# EAGLE design zamek (EAGLE 7.7.0)
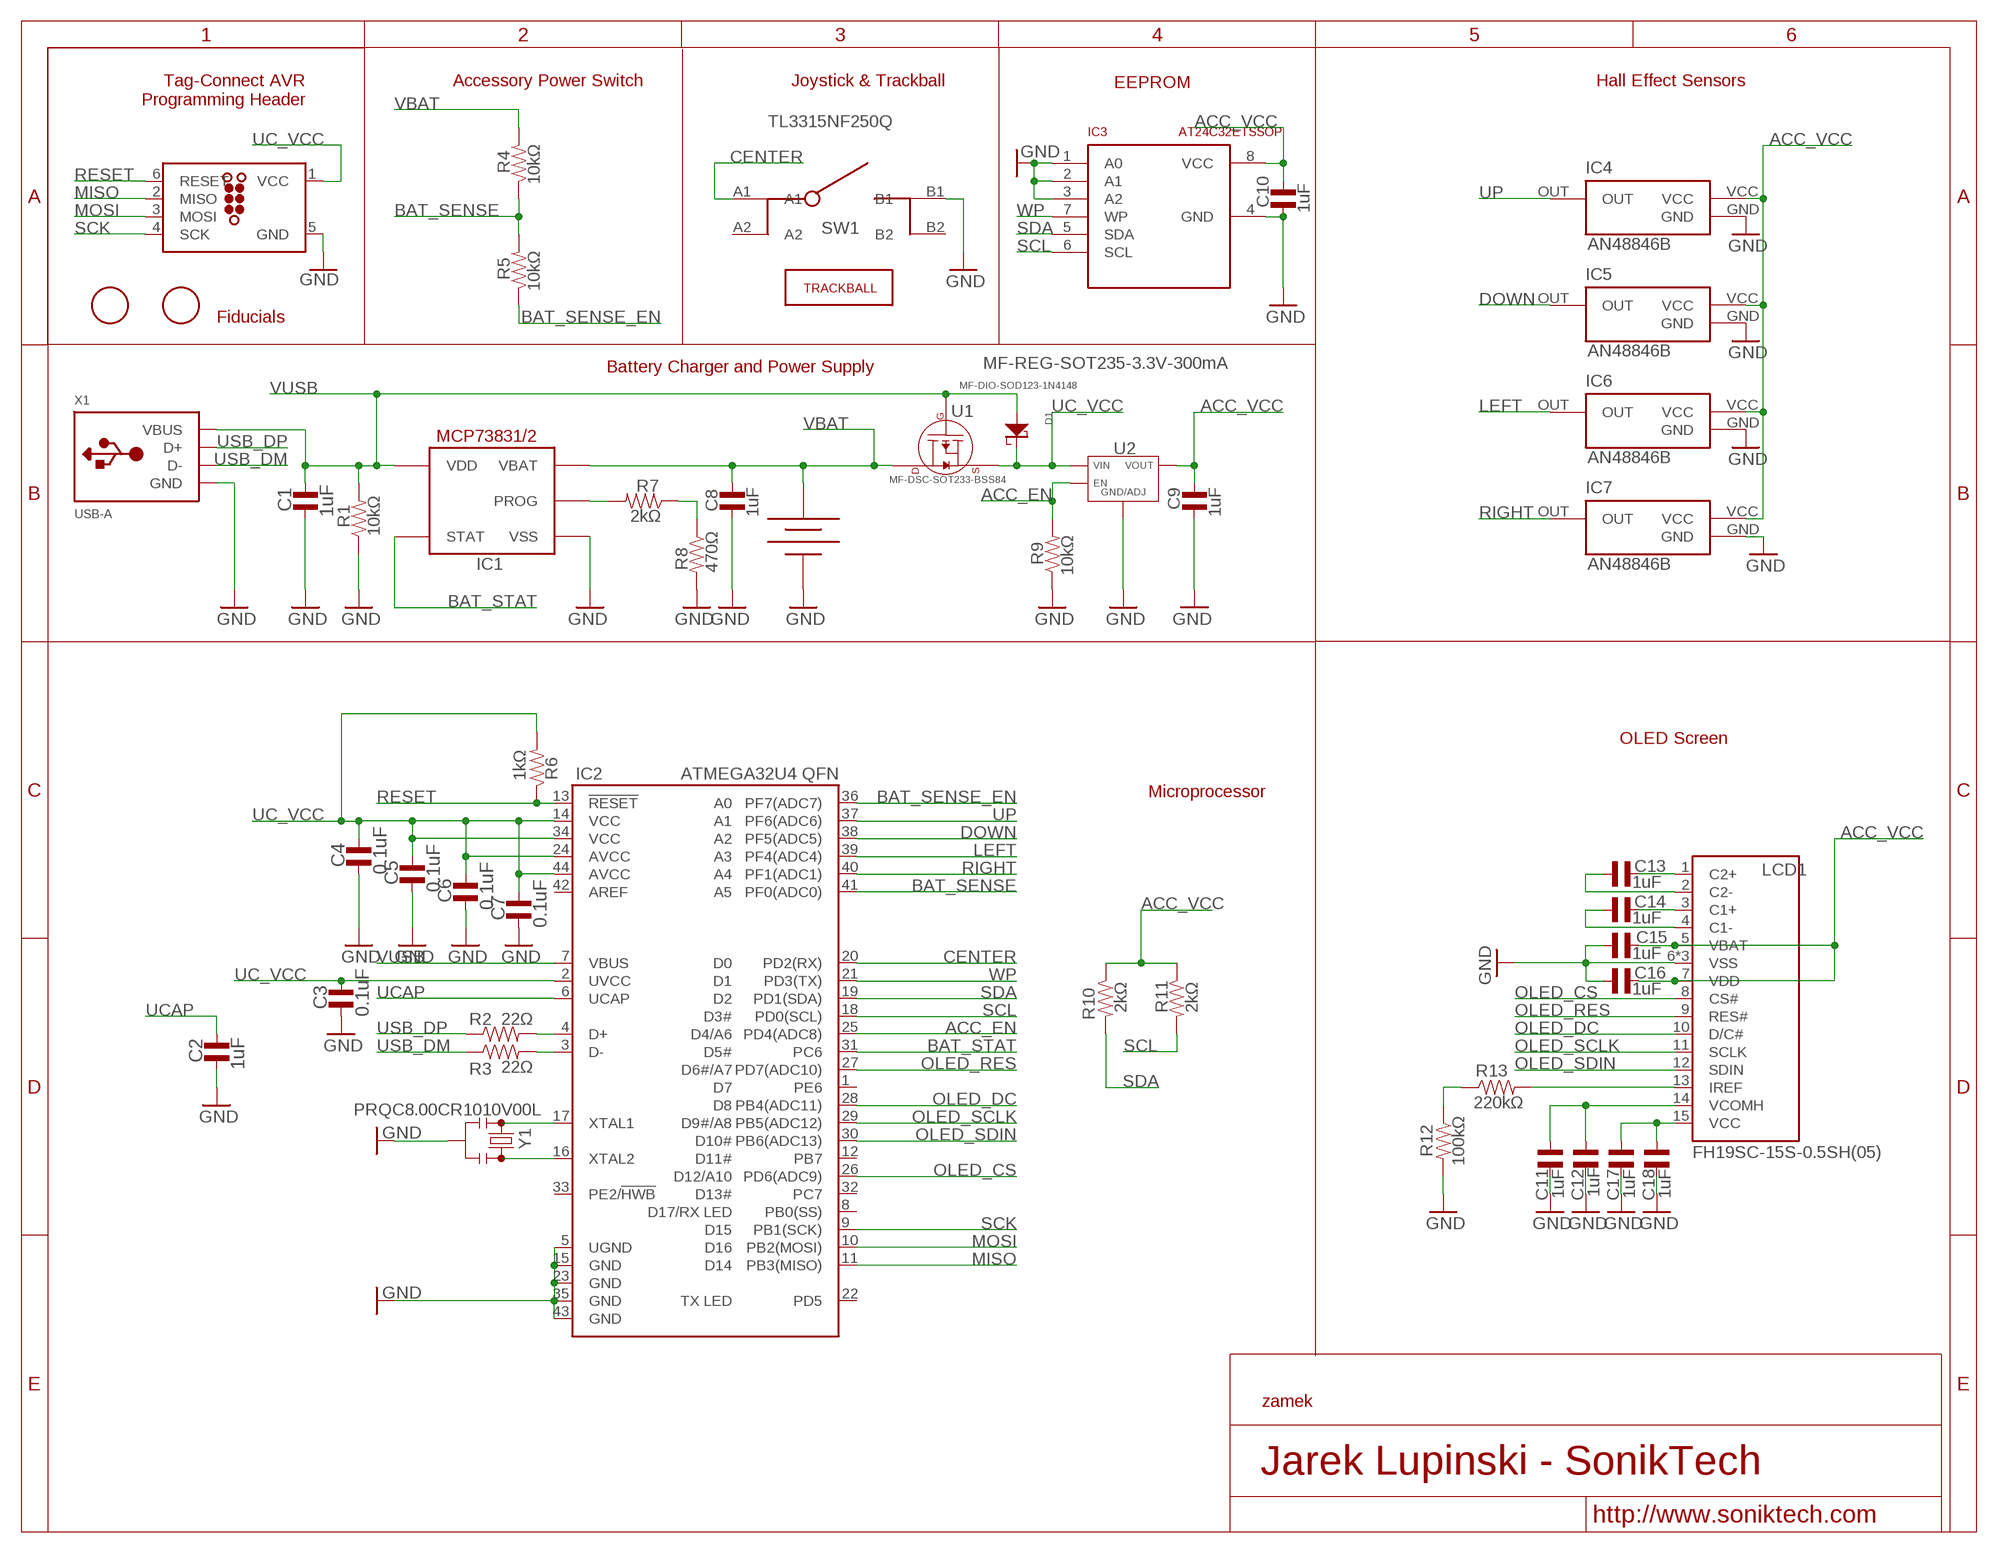
[diagram p0: schematic, sheet 1]

## Parts
BAT1  LIPO201030  [201030LIPO]
C1  1uF  CAPACITOR_NP_0402  [C0402]
C2  1uF  CAPACITOR_NP_0402  [C0402]
C3  0.1uF  CAPACITOR_NP_0402  [C0402]
C4  0.1uF  CAPACITOR_NP_0402  [C0402]
C5  0.1uF  CAPACITOR_NP_0402  [C0402]
C6  0.1uF  CAPACITOR_NP_0402  [C0402]
C7  0.1uF  CAPACITOR_NP_0402  [C0402]
C8  1uF  CAPACITOR_NP_0402  [C0402]
C9  1uF  CAPACITOR_NP_0402  [C0402]
C10  1uF  CAPACITOR_NP_0402  [C0402]
C11  1uF  CAPACITOR_NP_0402  [C0402]
C12  1uF  CAPACITOR_NP_0402  [C0402]
C13  1uF  CAPACITOR_NP_0402  [C0402]
C14  1uF  CAPACITOR_NP_0402  [C0402]
C15  1uF  CAPACITOR_NP_0402  [C0402]
C16  1uF  CAPACITOR_NP_0402  [C0402]
C17  1uF  CAPACITOR_NP_0402  [C0402]
C18  1uF  CAPACITOR_NP_0402  [C0402]
D1  MF-DIO-SOD123-1N4148  DIODES_SOD-123  [SOD-123]
IC1  MCP73831  MCP73831MF  [MFSOT23-5L]
IC2  ATMEGA32U4 QFN  ATMEGA32U4QFN2  [QFN-44-NOPAD]
IC3  AT24C32ETSSOP  [TSSOP8-W]
IC4  AN48846B  HALLSENSOR  [HALLSENSOR]
IC5  AN48846B  HALLSENSOR  [HALLSENSOR]
IC6  AN48846B  HALLSENSOR  [HALLSENSOR]
IC7  AN48846B  HALLSENSOR  [HALLSENSOR]
J1  TC2030-MCP-NLFIX  [TC2030-MCP-NL]
LCD1  FH19SC-15S-0.5SH(05)  MICROBUILDER_OLED_UG-2832HSWEG04  [ER-OLED0.91-3WWFH19C]
R1  10kΩ  RESISTOR_0402  [R0402]
R2  22Ω  RESISTOR_0402  [R0402]
R3  22Ω  RESISTOR_0402  [R0402]
R4  10kΩ  RESISTOR_0402  [R0402]
R5  10kΩ  RESISTOR_0402  [R0402]
R6  1kΩ  RESISTOR_0402  [R0402]
R7  2kΩ  RESISTOR_0402  [R0402]
R8  470Ω  RESISTOR_0402  [R0402]
R9  10kΩ  RESISTOR_0402  [R0402]
R10  2kΩ  RESISTOR_0402  [R0402]
R11  2kΩ  RESISTOR_0402  [R0402]
R12  100kΩ  RESISTOR_0402  [R0402]
R13  220kΩ  RESISTOR_0402  [R0402]
SW1  TL3315NF250Q  [TRACKBALLBUTTON]
SW2  TRACKBALLMECH  [TRACKBALL]
U1  MF-DSC-SOT233-BSS84  P-CHANNEL_FET_SOT-23-3  [SOT-23-3]
U2  MF-REG-SOT235-3.3V-300mA  TLV70233PDBVR  [SOT-23-5]
U$1  FIDUCIAL  [FIDUCIAL_1MM]
U$2  FIDUCIAL  [FIDUCIAL_1MM]
X1  USB-A  [MOLEX_480371000]
Y1  PRQC8.00CR1010V00L  RESONATOR8MHZ  [RESONATOR-SMD]

## Nets
ACC_EN: IC2.25(PD4(ADC8)) R9.P$2 U2.P$3(EN)
ACC_VCC [power]: C9.P$1 C10.P$1 C15.P$2 C16.P$1 IC3.8(VCC) IC4.VCC IC5.VCC IC6.VCC IC7.VCC LCD1.5(VBAT) LCD1.7(VDD) R10.P$1 R11.P$1 U2.P$5(VOUT)
BAT_SENSE: IC2.41(PF0(ADC0)) R4.P$1 R5.P$2
BAT_SENSE_EN [power]: IC2.36(PF7(ADC7)) R5.P$1
BAT_STAT: IC1.P$1(STAT) IC2.31(PC6)
CENTER: IC2.20(PD2(RX)) SW1.A1
DOWN: IC2.38(PF5(ADC5)) IC5.OUT
GND [power]: BAT1.NEG C1.P$2 C2.P$2 C3.P$2 C4.P$2 C5.P$2 C6.P$2 C7.P$2 C8.P$2 C9.P$2 C10.P$2 C11.P$2 C12.P$2 C15.P$1 C16.P$2 C17.P$2 C18.P$2 IC1.P$2(VSS) IC2.5(UGND) IC2.15(GND) IC2.23(GND) IC2.35(GND) IC2.43(GND) IC3.1(A0) IC3.2(A1) IC3.3(A2) IC3.4(GND) IC4.GND IC5.GND IC6.GND IC7.GND J1.5(GND) LCD1.6(VSS) LCD1.EP1(VSS) LCD1.EP2(VSS) R1.P$1 R8.P$2 R9.P$1 R12.P$2 SW1.B1 U2.P$2(GND/ADJ) U2.P$4(GND/ADJ) X1.4(GND) Y1.2
LEFT: IC2.39(PF4(ADC4)) IC6.OUT
MISO: IC2.11(PB3(MISO)) J1.2(MISO)
MOSI: IC2.10(PB2(MOSI)) J1.3(MOSI)
N$1: C13.P$1 LCD1.2(C2-)
N$2: C14.P$2 LCD1.3(C1+)
N$3: C14.P$1 LCD1.4(C1-)
N$4: C13.P$2 LCD1.1(C2+)
N$5: IC1.P$5(PROG) R7.P$2
N$6: R12.P$1 R13.P$1
N$7: IC2.16(XTAL2) Y1.3
N$8: LCD1.13(IREF) R13.P$2
N$9: C11.P$1 C12.P$1 LCD1.14(VCOMH)
N$10: IC2.4(D+) R2.P$2
N$11: IC2.3(D-) R3.P$2
N$12: IC2.17(XTAL1) Y1.1
N$13: R7.P$1 R8.P$1
N$15: C17.P$1 C18.P$1 LCD1.15(VCC)
OLED_CS: IC2.26(PD6(ADC9)) LCD1.8(CS#)
OLED_DC: IC2.28(PB4(ADC11)) LCD1.10(D/C#)
OLED_RES: IC2.27(PD7(ADC10)) LCD1.9(RES#)
OLED_SCLK: IC2.29(PB5(ADC12)) LCD1.11(SCLK)
OLED_SDIN: IC2.30(PB6(ADC13)) LCD1.12(SDIN)
RESET: IC2.13(!RESET) J1.6(RESET) R6.P$1
RIGHT: IC2.40(PF1(ADC1)) IC7.OUT
SCK: IC2.9(PB1(SCK)) J1.4(SCK)
SCL: IC2.18(PD0(SCL)) IC3.6(SCL) R11.P$2
SDA: IC2.19(PD1(SDA)) IC3.5(SDA) R10.P$2
UC_VCC [power]: C3.P$1 C4.P$1 C5.P$1 C6.P$1 C7.P$1 D1.CATHODE IC2.2(UVCC) IC2.14(VCC) IC2.24(AVCC) IC2.34(VCC) IC2.44(AVCC) J1.1(VCC) R6.P$2 U1.P$2(SOURCE) U2.P$1(VIN)
UCAP [power]: C2.P$1 IC2.6(UCAP)
UP: IC2.37(PF6(ADC6)) IC4.OUT
USB_DM: R3.P$1 X1.2(D-)
USB_DP: R2.P$1 X1.3(D+)
VBAT [power]: BAT1.POS C8.P$1 IC1.P$3(VBAT) R4.P$2 U1.P$3(DRAIN)
VUSB [power]: C1.P$1 D1.ANODE IC1.P$4(VDD) IC2.7(VBUS) R1.P$2 U1.P$1(GATE) X1.1(VBUS)
WP: IC2.21(PD3(TX)) IC3.7(WP)
Unconnected: IC2.1(PE6) IC2.8(PB0(SS)) IC2.12(PB7) IC2.22(PD5) IC2.32(PC7) IC2.33(PE2/!HWB) IC2.42(AREF) SW1.A2 SW1.B2

## Notes on the sheet
- Tag-Connect AVR
  Programming Header
- Accessory Power Switch | Joystick & Trackball | EEPROM | Hall Effect Sensors
- Fiducials
- Battery Charger and Power Supply
- OLED Screen
- Microprocessor

## Library data of the parts
BAT1 = sonik:LIPO201030
C1-C18 = MF_Passives:CAPACITOR_NP: Library: MF_Passives Description: Device for Non-Polarized Capacitors. Manufacture part number (MPN) can be added via Attributes. Check https://factory.macrofab.com/parts for the house parts list.; POPULATE: 1
D1 = MF_Discrete_Semiconductor:DIODES: Library: MF_Discrete_Semiconductor Description: Device for Single Packaged Diodes.; HOUSEPART: NO; POPULATE: 1
IC1 = adafruit:MCP73831: MCP73831/2 Miniature Single-Cell, Fully Integrated Li-Ion, Li-Polymer Charge Management Controllers. Nice and small simple lipoly charge controller, with adjustable current and status output (LED) http://www.ladyada.net/library/pcb/eaglelibrary.html
IC2 = SparkFun-DigitalIC:ATMEGA32U4: Atmel 44-pin 8-bit Microcontroller with 32KBytes of ISP Flash and USB Controller
IC3 = sonik:AT24C32E
IC4-IC7 = sonik:HALLSENSOR
J1 = sonik:TC2030: TAG-CONNECT ICSP Connector Manufacturer: Tag-Connect <http://www.tag-connect.com> Cable for easy In-Circuit Serial Programming. Designed for Microchip ICD2, suitable for many others. Two variants - one "with legs" (for hands-free fit on PCB) and another "without legs" for quick programming. PAD Description 1 MCLR/Vpp 2 Vdd 3 GND 4 PGD (ISPDAT) 5 PGC (ISPCLK) 6 nc (used for LVP) ©2009 ROFA.cz - modified and updated by Robert Darlington ‹rdarlington@gmail.com›
LCD1 = sonik:MICROBUILDER_OLED_UG-2832HSWEG04: 128x32 SPI 0.91" Monochrome OLED Display
R1-R13 = MF_Passives:RESISTOR: Library: MF_Passives Description: Device for Resistors. Manufacture part number (MPN), Voltage, Tolerance, and Wattage Rating can be added via Attributes. Check https://factory.macrofab.com/parts for the house parts list.; POPULATE: 1
SW1 = sonik:TL3315NF250Q
SW2 = SparkFun-Electromechanical:TRACKBALL: Mechanical footprint for trackball; PROD_ID: COMP-09237
U1 = MF_Discrete_Semiconductor:P-CHANNEL_FET: Library: MF_Discrete_Semiconductor Description: Device for Single P-Channel Mosfet. Manufacture part number (MFG#) can be added via Attributes.; HOUSEPART: NO; POPULATE: 1
U2 = MF_IC_Power:TLV702: Manufacturer Part #: TLV702 Manufacturer: Texas Instruments Description: LDO Voltage Regulators; HOUSEPART: YES; MPN: F-REG-SOT235-3.3V-300mA; POPULATE: 1; URL: https://factory.macrofab.com/part/MF-REG-SOT235-3.3V-300mA; VALUE: F-REG-SOT235-3.3V-300mA
U$1 U$2 = adafruit:FIDUCIAL: For use by pick and place machines to calibrate the vision/machine, 1mm By microbuilder.eu
X1 = adafruit:USB-A: USB type A 'plug' Used for things that can directly connect to a USB port, say USB key
Y1 = SparkFun-FreqCtrl:RESONATOR: Resonator Small SMD resonator. Used, eg, on the Arduino Pro/ Pro Mini boards. 8MHz- XTAL-08895 16MHz- XTAL-08900; PROD_ID: XTAL-08895; VALUE: 8MHZ

## Net classes
1 power: width 0.203 mm

## Board
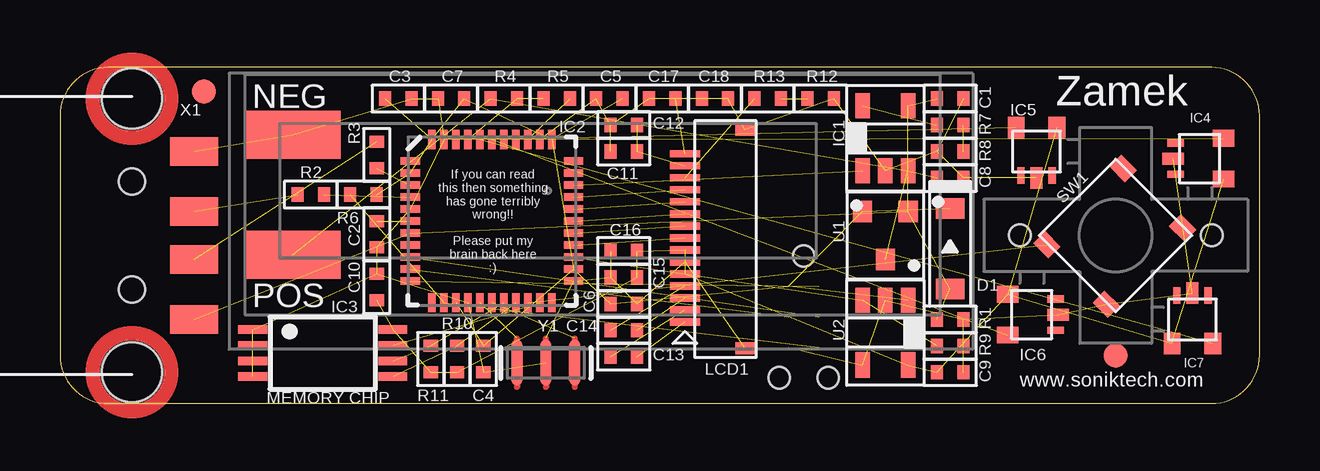
[diagram p1: board, top side]
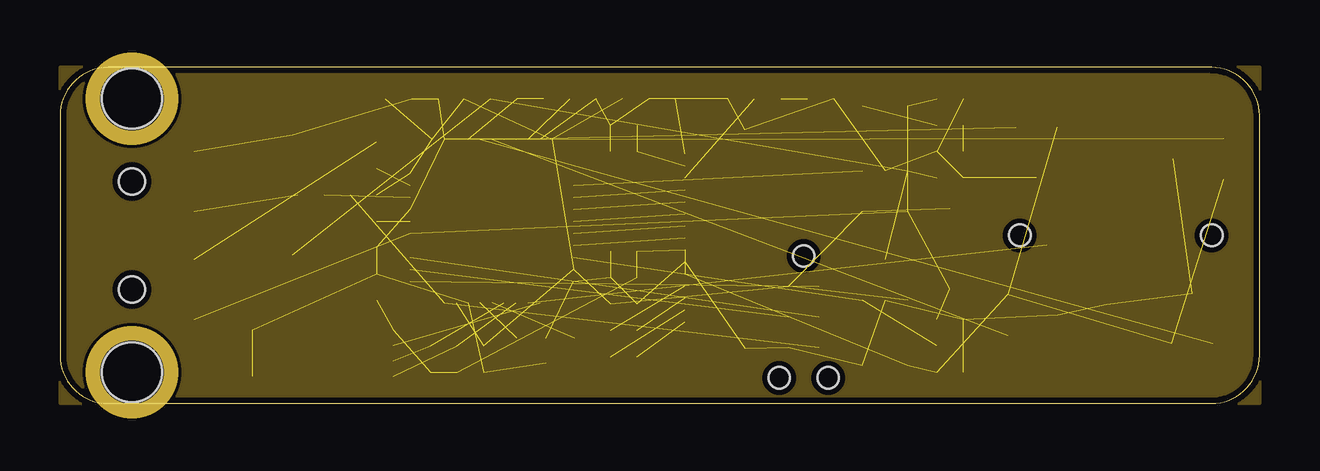
[diagram p2: board, inner layer GND]
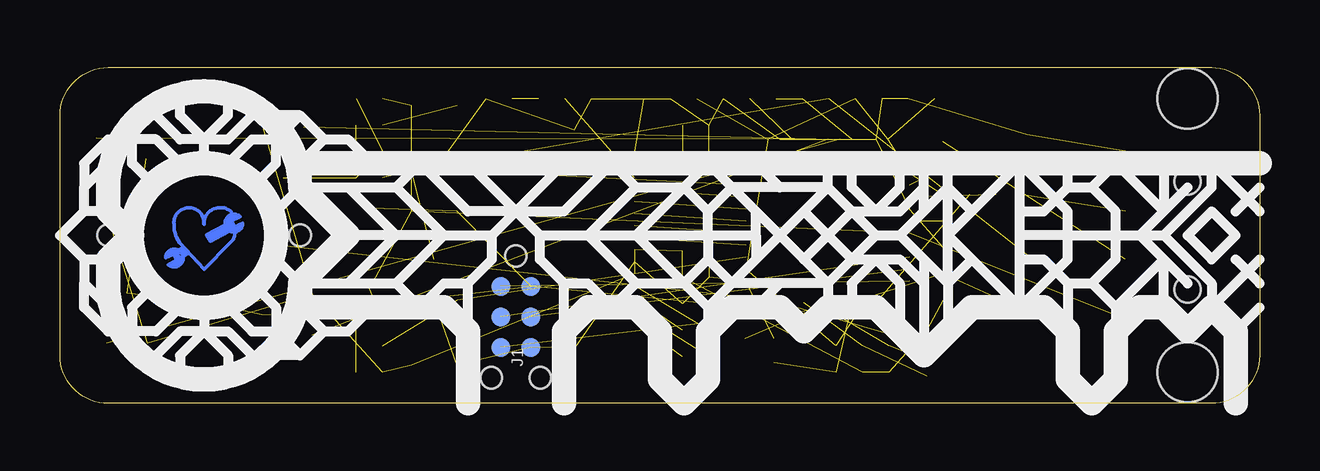
[diagram p3: board, bottom side, seen from below]

Size 50 x 14 mm. Coordinates in mm from the lower left corner, seen from the top.
Outline: 48,14 2,14 arc90 0,12 0,2 arc90 2,0 48,0 arc90 50,2 50,12 arc90 48,14
Copper layers (1*2*15*16): Top 0.035mm / dielectric 0.23mm / VCC 0.035mm / dielectric 0.93mm / GND 0.035mm / dielectric 0.23mm / Bottom 0.035mm
Design rules "MF_Standard_4_Layer": minimum track width 5mil, minimum drill 12mil, track to track 5mil, track to pad 5mil, pad to pad 5mil, via to via 5mil, smd to smd 0mil, copper to edge 10mil, drill to drill 10mil, minimum pad ring 6mil, minimum via ring 6mil, stop-mask expansion 2mil, vias tented up to drill 25mil, thermal gap 10mil

### Footprints (pad centres in the part's own frame; a part is rotated, then mirrored left to right if it is on the bottom)
201030LIPO = smd 4 x 2: NEG 14,-2.5; POS 14,2.5
C0402 = smd 0.5 x 0.6: P$1 -0.55,0; P$2 0.55,0
SOD-123 = smd 0.85 x 1.2: ANODE 1.675,0; CATHODE -1.675,0
MFSOT23-5L = smd 1.05 x 0.6: P$1 -1.35,0.95; P$2 -1.35,0; P$3 -1.35,-0.95; P$4 1.35,-0.95; P$5 1.35,0.95
QFN-44-NOPAD = smd 0.8 x 0.3: 1 -3.4,2.5; 2 -3.4,2; 3 -3.4,1.5; 4 -3.4,1; 5 -3.4,0.5; 6 -3.4,0; 7 -3.4,-0.5; 8 -3.4,-1; 9 -3.4,-1.5; 10 -3.4,-2; 11 -3.4,-2.5; 23 3.4,-2.5; 24 3.4,-2; 25 3.4,-1.5; 26 3.4,-1; 27 3.4,-0.5; 28 3.4,0; 29 3.4,0.5; 30 3.4,1; 31 3.4,1.5; 32 3.4,2; 33 3.4,2.5 | smd 0.3 x 0.8: 12 -2.5,-3.4; 13 -2,-3.4; 14 -1.5,-3.4; 15 -1,-3.4; 16 -0.5,-3.4; 17 0,-3.4; 18 0.5,-3.4; 19 1,-3.4; 20 1.5,-3.4; 21 2,-3.4; 22 2.5,-3.4; 34 2.5,3.4; 35 2,3.4; 36 1.5,3.4; 37 1,3.4; 38 0.5,3.4; 39 0,3.4; 40 -0.5,3.4; 41 -1,3.4; 42 -1.5,3.4; 43 -2,3.4; 44 -2.5,3.4
TSSOP8-W = smd 1.2 x 0.35: 1 -2.925,0.975; 2 -2.925,0.325; 3 -2.925,-0.325; 4 -2.925,-0.975; 5 2.925,-0.975; 6 2.925,-0.325; 7 2.925,0.325; 8 2.925,0.975
HALLSENSOR = smd 0.5 x 0.9: GND 0,1.1 | smd 0.3 x 0.7: NC1 -0.65,1; NC2 0.65,1 | smd 0.7 x 0.9: OUT 0.85,-1; VCC -0.85,-1
TC2030-MCP-NL = smd 0.787 x 0.787: 1 4.73,-0.635; 2 4.73,0.635; 3 3.46,-0.635; 4 3.46,0.635; 5 2.19,-0.635; 6 2.19,0.635 | hole 0.889: 6,0; 0.92,-1.016; 0.92,1.016
ER-OLED0.91-3WWFH19C = smd 1.25 x 0.3: 1 3.5,-4.602; 2 3.5,-4.102; 3 3.5,-3.602; 4 3.5,-3.102; 5 3.5,-2.602; 6 3.5,-2.102; 7 3.5,-1.602; 8 3.5,-1.102; 9 3.5,-0.602; 10 3.5,-0.102; 11 3.5,0.402; 12 3.5,0.902; 13 3.5,1.402; 14 3.5,1.902; 15 3.5,2.402 | smd 0.8 x 0.5: EP1 6,3.398; EP2 6,-5.702
R0402 = smd 0.5 x 0.6: P$1 -0.55,0; P$2 0.55,0
TRACKBALLBUTTON = smd 0.7 x 0.9: A1 -2.3,1.75; A2 2.2,1.75; B1 -2.3,-1.75; B2 2.2,-1.75
TRACKBALL = hole 0.9: -4,0; 4,0
SOT-23-3 = smd 0.9 x 0.8: P$1 -1,0.95; P$2 -1,-0.95; P$3 1,0
SOT-23-5 = smd 1.05 x 0.6: P$1 -1.35,0.95; P$2 -1.35,0; P$3 -1.35,-0.95; P$4 1.35,-0.95; P$5 1.35,0.95
FIDUCIAL_1MM = smd 1 x 1: 1 0,0
MOLEX_480371000 = smd 1.2 x 2: 1 3.5,2.6; 2 1,2.6; 3 -1,2.6; 4 -3.5,2.6 | hole 1.1: -2.25,0; 2.25,0 | hole 2.5: -5.7,0; 5.7,0
RESONATOR-SMD = smd 0.45 x 1.905: 1 -1.2,0; 2 0,0; 3 1.2,0

### Placement (x,y rotation side)
BAT1  23.7,8.7 180 top
C1  37.1,12.7 0 top
C2  13.2,7.05 270 top
C3  14.1,12.7 0 top
C4  17.65,1.85 270 top
C5  22.9,12.7 180 top
C6  23.5,4.15 0 top
C7  16.3,12.7 180 top
C8  37.1,9.4 0 top
C9  37.1,1.3 0 top
C10  13.2,4.85 90 top
C11  23.5,10.5 180 top
C12  23.5,11.6 180 top
C13  23.5,1.95 0 top
C14  23.5,3.05 0 top
C15  23.5,5.25 0 top
C16  23.5,6.35 180 top
C17  25.1,12.7 180 top
C18  27.3,12.7 0 top
D1  37.1,6.45 270 top
IC1  34.4,11.05 90 top
IC2  18,7.6 0 top
IC3  10.95,2.1 0 top
IC4  47.5,10.2 90 top
IC5  40.7,10.5 180 top
IC6  40.5,3.7 270 top
IC7  47.2,3.5 0 top
J1  31,0.15 90 bottom
LCD1  22.55,8 0 top
R1  37.1,3.5 180 top
R2  10.45,8.7 0 top
R3  13.2,10.35 270 top
R4  18.5,12.7 180 top
R5  20.7,12.7 180 top
R6  12.65,8.7 0 top
R7  37.1,11.6 180 top
R8  37.1,10.5 180 top
R9  37.1,2.4 180 top
R10  16.55,1.85 90 top
R11  15.45,1.85 90 top
R12  31.7,12.7 0 top
R13  29.5,12.7 180 top
SW1  44,7 45 top
SW2  44,7 0 top
U1  34.4,7 270 top
U2  34.4,2.95 270 top
U$1  6,13 0 top
U$2  44,2 0 top
X1  3,7 270 top
Y1  20.25,1.7 180 top

### Tracks (layer width: path | path; a pad name or v marks a point on that pad's centre or on a via)
ACC_EN  (2 unrouted)
ACC_VCC  (13 unrouted)
BAT_SENSE  (2 unrouted)
BAT_SENSE_EN  (1 unrouted)
BAT_STAT  (1 unrouted)
CENTER  (1 unrouted)
DOWN  (1 unrouted)
GND  (43 unrouted)
  pour GND: 0,14 50,14 50,0 0,0
LEFT  (1 unrouted)
MISO  (1 unrouted)
MOSI  (1 unrouted)
N$1  (1 unrouted)
N$2  (1 unrouted)
N$3  (1 unrouted)
N$4  (1 unrouted)
N$5  (1 unrouted)
N$6  (1 unrouted)
N$7  (1 unrouted)
N$8  (1 unrouted)
N$9  (2 unrouted)
N$10  (1 unrouted)
N$11  (1 unrouted)
N$12  (1 unrouted)
N$13  (1 unrouted)
N$14
  Bottom 0.152: 44,7.46 arc-191 45.25,7.48
N$15  (2 unrouted)
N$16
  Bottom 0.152: 44.01,7.49 arc131 42.86,7.99
N$17
  Bottom 0.152: 43.14,7.43 43.88,7.03 43.72,6.75 42.94,7.18
N$18
  Bottom 0.152: 45.02,6.7 44,5.6
N$19
  Bottom 0.152: 42.7,7.1 arc41 42.9,6.7 44,5.6
N$20
  Bottom 0.152: 42.38,7.5 42.72,7.37 42.84,7.62 42.5,7.79 arc-310 42.38,7.5
N$21
  Bottom 0.152: 45.25,7.46 45.25,7.45 arc-34 45.02,6.7
N$22
  Bottom 0.152: 43.78,6.86 43.13,7.21
N$23
  Bottom 0.152: 44.84,6.15 44.64,6.28 45.04,6.28 45.04,6.4 44.84,6.51
N$24
  Bottom 0.152: 45.6,6.08 45.26,6.21 45.14,5.96 45.48,5.79 arc-310 45.6,6.08
N$25
  Bottom 0.152: 43.81,6.94 43.15,7.29
N$26
  Bottom 0.152: 42.67,7.78 42.8,7.77 42.89,7.72 42.97,7.64 43,7.55 43.02,7.45 43.01,7.36 42.95,7.33 42.91,7.29 42.8,7.27 42.64,7.28 42.5,7.33 42.84,7.33 42.89,7.42 42.9,7.54
N$27
  Bottom 0.152: 44.87,6.39 44.82,6.3 44.94,6.25 45.07,6.3 45.18,6.33 45.29,6.31 45.41,6.26 45.46,6.22 45.21,6.23 45.11,6.19 45.01,6.12 45.02,6.01 44.98,5.99 44.98,6.04 45.14,6.07 45.05,5.96 45.01,5.91 45.08,5.89 45.11,5.82 45.18,5.82 45.24,5.81
N$28
  Bottom 0.152: 45.3,5.79 45.35,5.77
OLED_CS  (1 unrouted)
OLED_DC  (1 unrouted)
OLED_RES  (1 unrouted)
OLED_SCLK  (1 unrouted)
OLED_SDIN  (1 unrouted)
RESET  (2 unrouted)
RIGHT  (1 unrouted)
SCK  (1 unrouted)
SCL  (2 unrouted)
SDA  (2 unrouted)
UC_VCC  (14 unrouted)
UCAP  (1 unrouted)
UP  (1 unrouted)
USB_DM  (1 unrouted)
USB_DP  (1 unrouted)
VBAT  (4 unrouted)
VUSB  (6 unrouted)
WP  (1 unrouted)

### Text on the board
tPlace: If you can read / this then something / has gone terribly / wrong!! / / Please put my / brain back here / :)
tNames: NEG | IC5 | Zamek | IC4 | SW1 | POS | IC6 | IC7 | www.soniktech.com | MEMORY CHIP